# Altium schematic sheet SCB_Top_Sheet.SchDoc
size A4
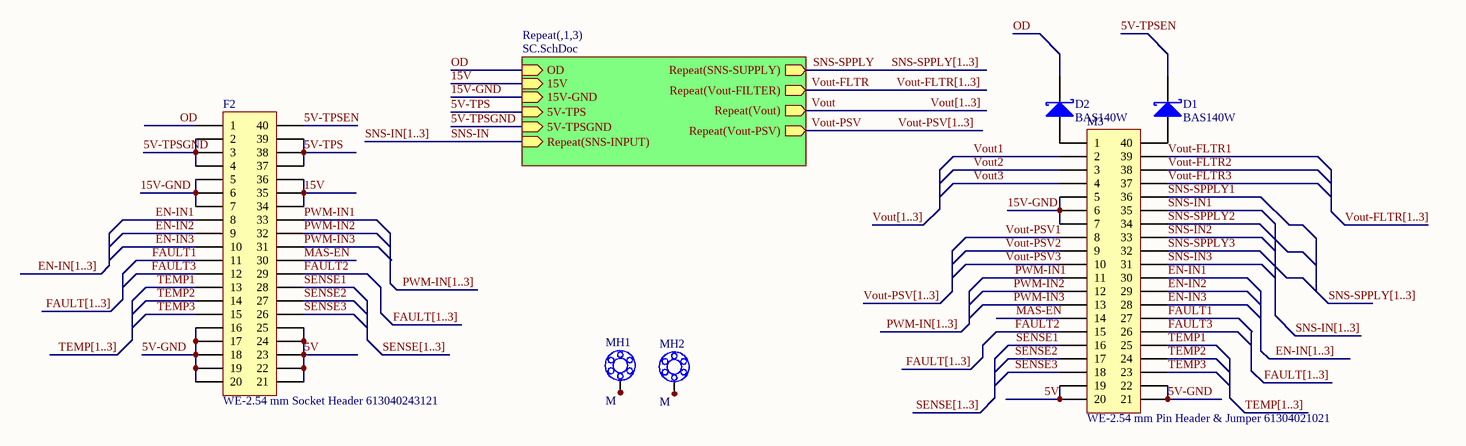
[diagram p0: SCB_Top_Sheet.SchDoc]

## Parts
D1  BAS140W  [SOD-323]
D2  BAS140W  [SOD-323]
F2  WE-2.54 mm Socket Header 613040243121  [613040243121]
M3  WE-2.54 mm Pin Header & Jumper 61304021021  [61304021021]
MH1  M  [MOUNTING]  (no BOM)
MH2  M  [MOUNTING]  (no BOM)

## Sub-sheets
Repeat(,1,3) = SC.SchDoc: OD (in), Repeat(SNS-SUPPLY) (out), 5V-TPS (in), Repeat(SNS-INPUT) (in), Repeat(Vout-FILTER) (out), Repeat(Vout) (out), 5V-TPSGND (in), 15V-GND (in), 15V (in), Repeat(Vout-PSV) (out)

## Nets
5V: F2.21 F2.22 F2.23 F2.24 F2.25 M3.19 M3.20
5V-GND: F2.16 F2.17 F2.18 F2.19 F2.20 M3.21 M3.22
5V-TPS: F2.37 F2.38 F2.39 ; sheet Repeat(,1,3)/5V-TPS
5V-TPSEN: D1.1(K) F2.40
5V-TPSGND: F2.2 F2.3 F2.4 ; sheet Repeat(,1,3)/5V-TPSGND
15V: F2.34 F2.35 F2.36 ; sheet Repeat(,1,3)/15V
15V-GND: F2.5 F2.6 F2.7 M3.5 M3.6 M3.7 ; sheet Repeat(,1,3)/15V-GND
EN-IN1: F2.8 M3.30
EN-IN2: F2.9 M3.29
EN-IN3: F2.10 M3.28
FAULT1: F2.11 M3.27
FAULT2: F2.29 M3.15
FAULT3: F2.12 M3.26
MAS-EN: F2.30 M3.14
OD: D2.1(K) F2.1 ; sheet Repeat(,1,3)/OD
PWM-IN1: F2.33 M3.11
PWM-IN2: F2.32 M3.12
PWM-IN3: F2.31 M3.13
SENSE1: F2.28 M3.16
SENSE2: F2.27 M3.17
SENSE3: F2.26 M3.18
SNS-IN: sheet Repeat(,1,3)/Repeat(SNS-INPUT)
SNS-IN1: M3.35
SNS-IN2: M3.33
SNS-IN3: M3.31
SNS-SPPLY: sheet Repeat(,1,3)/Repeat(SNS-SUPPLY)
SNS-SPPLY1: M3.36
SNS-SPPLY2: M3.34
SNS-SPPLY3: M3.32
TEMP1: F2.13 M3.25
TEMP2: F2.14 M3.24
TEMP3: F2.15 M3.23
Vout: sheet Repeat(,1,3)/Repeat(Vout)
Vout1: M3.2
Vout2: M3.3
Vout3: M3.4
Vout-FLTR: sheet Repeat(,1,3)/Repeat(Vout-FILTER)
Vout-FLTR1: M3.39
Vout-FLTR2: M3.38
Vout-FLTR3: M3.37
Vout-PSV: sheet Repeat(,1,3)/Repeat(Vout-PSV)
Vout-PSV1: M3.8
Vout-PSV2: M3.9
Vout-PSV3: M3.10
NetD1_2: D1.2(A) M3.40
NetD2_2: D2.2(A) M3.1
NetMH1_1: MH1.1 MH1.2 MH1.3 MH1.4 MH1.5 MH1.6 MH1.7 MH1.8 MH1.9
NetMH2_1: MH2.1 MH2.2 MH2.3 MH2.4 MH2.5 MH2.6 MH2.7 MH2.8 MH2.9

## Buses and harness runs
bus EN-IN[1..3]
bus FAULT[1..3]
bus PWM-IN[1..3]
bus SENSE[1..3]
bus SNS-IN[1..3]
bus SNS-SPPLY[1..3]
bus TEMP[1..3]
bus Vout-FLTR[1..3]
bus Vout-PSV[1..3]
bus Vout[1..3]

## Library data of the parts
D1 D2 = BAS140W: Silicon AF Schottky Diode for High-Speed Switching; Published: 21-Mar-2003; LatestRevisionDate: 19-Mar-2004; LatestRevisionNote: Silkscreen size reduced.; DatasheetDocument: Oct-1999; PackageDocument: Sep-2000; PackageReference: SOD-323; Publisher: Altium Limited; ComponentLink1Description: Manufacturer Link; ComponentLink1URL: http://www.infineon.com/; ComponentLink2Description: Datasheet; ComponentLink2URL: http://www.infineon.com/upload/Document/cmc_upload/documents/009/386/bas70_bas170series_1.pdf
F2 = WE-2.54 mm Socket Header 613040243121: WR-PHD 2.54 mm Angled Socket Header; Manufacturer: W¨¹rth Elektronik eiSos GmbH; ComponentLink1 Description: Manufacturer; ComponentLink2 Description: Datasheet; NoPins: 40; Created Date: 29 March 2013; partNo: 613040243121; ComponentLink1URL: http://www.we-online.com; ComponentLink2URL: http://katalog.we-online.de/em/datasheet/6130xx243121.pdf; Created by: Karrer Zheng
M3 = WE-2.54 mm Pin Header & Jumper 61304021021: WR-PHD 2.54 mm Angled Dual Pin Header; Manufacturer: W¨¹rth Elektronik eiSos GmbH; ComponentLink1 Description: Manufacturer; ComponentLink2 Description: Datasheet; NoPins: 40; Created Date: 25 March 2013; partNo: 61304021021; ComponentLink1URL: http://www.we-online.com; ComponentLink2URL: http://katalog.we-online.de/em/datasheet/6130xx21021.pdf; Created by: Karrer Zheng
MH1 MH2 = MOUNTING: MOUNTING HOLE - NON INSTALLABLE